# Altium schematic sheet ComparatorSense.SchDoc
size A3; SheetNumber: 6; SheetTotal: 7
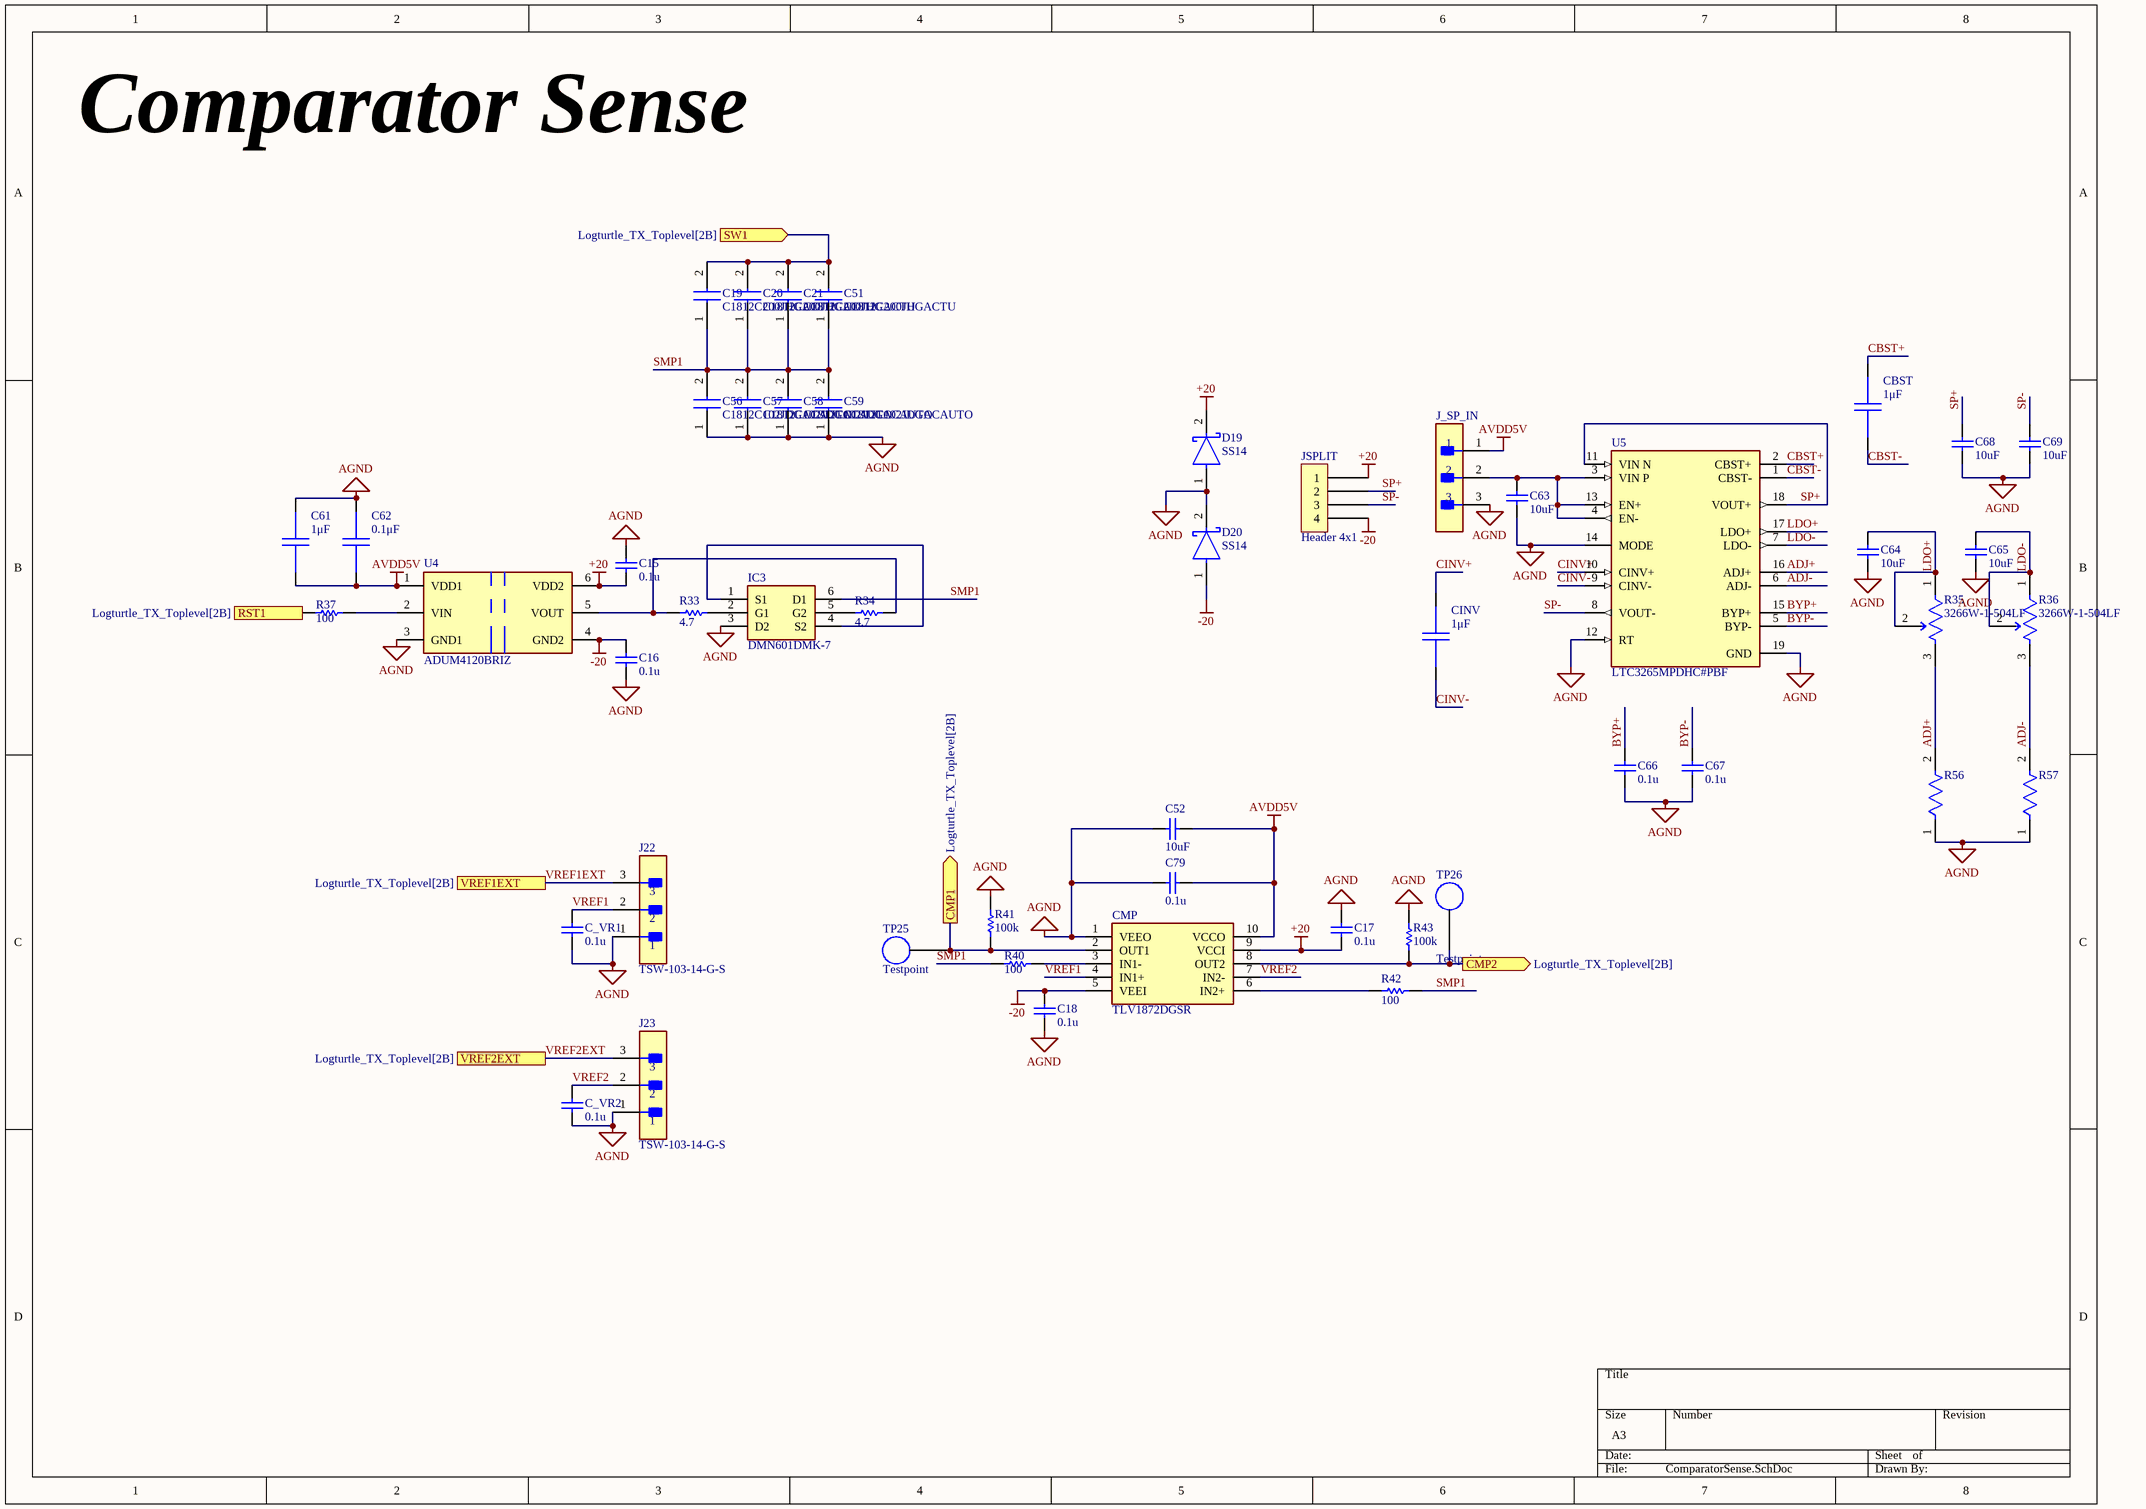
[diagram p0: ComparatorSense.SchDoc]

## Parts
C15  value 0.1u  [CAPC1608X09N]  (hidden comment: Capacitor)
C16  value 0.1u  [CAPC1608X09N]  (hidden comment: Capacitor)
C17  value 0.1u  [CAPC1608X09N]  (hidden comment: Capacitor)
C18  value 0.1u  [CAPC1608X09N]  (hidden comment: Capacitor)
C19  C1812C200JHGACTU  [C1812]
C20  C1812C200JHGACTU  [C1812]
C21  C1812C200JHGACTU  [C1812]
C51  C1812C200JHGACTU  [C1812]
C52  value 10uF  [CAPC2012X14N]  (hidden comment: 10μF)
C56  C1812C102JDGACAUTO  [C1812]
C57  C1812C102JDGACAUTO  [C1812]
C58  C1812C102JDGACAUTO  [C1812]
C59  C1812C102JDGACAUTO  [C1812]
C61  1μF  [CAPC1608X09N]
C62  0.1μF  [CAPC1608X90N]
C63  value 10uF  [CAPC2012X14N]  (hidden comment: 10μF)
C64  value 10uF  [CAPC2012X14N]  (hidden comment: 10μF)
C65  value 10uF  [CAPC2012X14N]  (hidden comment: 10μF)
C66  value 0.1u  [CAPC1608X09N]  (hidden comment: Capacitor)
C67  value 0.1u  [CAPC1608X09N]  (hidden comment: Capacitor)
C68  value 10uF  [CAPC2012X14N]  (hidden comment: 10μF)
C69  value 10uF  [CAPC2012X14N]  (hidden comment: 10μF)
C79  value 0.1u  [CAPC1608X09N]  (hidden comment: Capacitor)
C_VR1  value 0.1u  [CAPC1608X09N]  (hidden comment: Capacitor)
C_VR2  value 0.1u  [CAPC1608X09N]  (hidden comment: Capacitor)
CBST  1μF  [CAPC1608X09N]
CINV  1μF  [CAPC1608X09N]
CMP  TLV1872DGSR  [SOP50P490X110-10N]
D19  SS14  [FP-403AE-MFG]
D20  SS14  [FP-403AE-MFG]
IC3  DMN601DMK-7  [SOT95P285X140-6N]
J22  TSW-103-14-G-S  [FP-TSW-103-14-G-S-MFG]
J23  TSW-103-14-G-S  [FP-TSW-103-14-G-S-MFG]
J_SP_IN  TSW-103-14-G-S  [FP-TSW-103-14-G-S-MFG]  (value not drawn)
JSPLIT  Header 4x1  [HDRV4W64P0X254_1X4_1016X250X901P]
R33  value 4.7  [RESC1608X55N]  (hidden comment: RC0603FR-07100RL)
R34  value 4.7  [RESC1608X55N]  (hidden comment: RC0603FR-07100RL)
R35  3266W-1-504LF  [FP-3266W-MFG]
R36  3266W-1-504LF  [FP-3266W-MFG]
R37  value 100  [RESC1608X55N]  (hidden comment: RC0603FR-07100RL)
R40  value 100  [RESC1608X55N]  (hidden comment: RC0603FR-07100RL)
R41  value 100k  [RESC1608X55N]  (hidden comment: RC0603FR-07100KL)
R42  value 100  [RESC1608X55N]  (hidden comment: RC0603FR-07100RL)
R43  value 100k  [RESC1608X55N]  (hidden comment: RC0603FR-07100KL)
R56  TNPU060350K0HZEN00  [FP-TNPU0603-e3-MFG]  (value not drawn)
R57  TNPU060350K0HZEN00  [FP-TNPU0603-e3-MFG]  (value not drawn)
TP25  Testpoint  [TP_5006]
TP26  Testpoint  [TP_5006]
U4  ADUM4120BRIZ  [FP-RI-6-1-IPC_A]
U5  LTC3265MPDHC#PBF  [FP-DHC-18-05-08-1955-IPC_C]

## Ports
CMP1 (out, see Logturtle_TX_Toplevel[2B]), CMP2 (out, see Logturtle_TX_Toplevel[2B]), RST1 (in, see Logturtle_TX_Toplevel[2B]), SW1 (in, see Logturtle_TX_Toplevel[2B]), VREF1EXT (see Logturtle_TX_Toplevel[2B]), VREF2EXT (see Logturtle_TX_Toplevel[2B])

## Nets
+20: C15.2 C17.2 CMP.9(VCCI) D19.2(C) JSPLIT.1 U4.6(VDD2)
-20: C16.2 C18.2 CMP.5(VEEI) D20.1(A) JSPLIT.4 U4.4(GND2)
AGND: C15.1 C16.1 C17.1 C18.1 C52.1 C56.1 C57.1 C58.1 C59.1 C61.1 C62.1 C63.1 C64.1 C65.1 C66.2 C67.2 C68.1 C69.1 C79.2 C_VR1.1 C_VR2.1 CMP.1(VEEO) D19.1(A) D20.2(C) IC3.3(D2) J22.1 J23.1 J_SP_IN.3 R41.1 R43.1 R56.1 R57.1 U4.3(GND1) U5.12(RT) U5.14(MODE) U5.19(GND)
AVDD5V: C52.2 C61.2 C62.2 C79.1 CMP.10(VCCO) J_SP_IN.1 U4.1(VDD1)
ADJ+: R35.3(CW) R56.2 U5.16(ADJ+)
ADJ-: R36.3(CW) R57.2 U5.6(ADJ-)
BYP+: C66.1 U5.15(BYP+)
BYP-: C67.1 U5.5(BYP-)
CBST+: CBST.1 U5.2(CBST+)
CBST-: CBST.2 U5.1(CBST-)
CINV+: CINV.1 U5.10(CINV+)
CINV-: CINV.2 U5.9(CINV-)
CMP1: CMP.2(OUT1) R41.2 TP25.1 ; port CMP1
CMP2: CMP.8(OUT2) R43.2 TP26.1 ; port CMP2
LDO+: C64.2 R35.1(CCW) R35.2(WIPER) U5.17(LDO+)
LDO-: C65.2 R36.1(CCW) R36.2(WIPER) U5.7(LDO-)
RST1: R37.1 ; port RST1
SMP1: C19.1 C20.1 C21.1 C51.1 C56.2 C57.2 C58.2 C59.2 IC3.6(D1) R40.1 R42.1
SP+: C68.2 JSPLIT.2 U5.11(VIN_N) U5.18(VOUT+)
SP-: C69.2 JSPLIT.3 U5.8(VOUT-)
SW1: C19.2 C20.2 C21.2 C51.2 ; port SW1
VREF1: C_VR1.2 CMP.4(IN1+) J22.2
VREF1EXT: J22.3 ; port VREF1EXT
VREF2: C_VR2.2 CMP.7(IN2-) J23.2
VREF2EXT: J23.3 ; port VREF2EXT
NetC63_2: C63.2 J_SP_IN.2 U5.3(VIN_P) U5.4(EN-) U5.13(EN+)
NetCMP_3: CMP.3(IN1-) R40.2
NetCMP_6: CMP.6(IN2+) R42.2
NetIC3_1: IC3.1(S1) IC3.4(S2)
NetIC3_2: IC3.2(G1) R33.1
NetIC3_5: IC3.5(G2) R34.2
NetR33_2: R33.2 R34.1 U4.5(VOUT)
NetR37_2: R37.2 U4.2(VIN)

## Notes on the sheet
- Comparator Sense

## Library data of the parts
C15-C18 C66 C67 C79 C_VR1 C_VR2 = Capacitor: SimulationGenericComponent: True
C19-C21 C51 C56-C59 = C1812C102JDGACAUTO: Capacitor; Manufacturer_Name: YAGEO; Datasheet Link: https://content.kemet.com/datasheets/KEM_C1080_C0G_HV_AUTO_SMD.pdf; Height: 1.55mm; Manufacturer_Part_Number: C1812C102JDGACAUTO
C52 C63-C65 C68 C69 = GRM21BZ71E106KE15L: Multilayer Ceramic Capacitor, 10 uF, 25 V, ï¿½ 10%, X7R, 0805 [2012 Metric] https://www.digikey.ie/en/products/detail/murata-electronics/GRM21BZ71E106KE15L/13904911; Manufacturer: Murata; Material: 4241ConductorMaterial; Voltage Rating: 25V; Supplier: Future Electronics; Supplier Part Number: 6134628; Manufacturer Part Number: GRM21BZ71E106KE15L; Category: Ceramic Capacitors; Stock: 81000; Case/Package: 339Case; Min Operating Temperature: -55°C; Max Operating Temperature: 125°C; Tolerance: 10%; Length: 2mm; Width: 1.25mm; Height: 1.45mm; Thickness: 1.25mm; RoHS Compliant: Yes; ComponentLink1URL: https://datasheet.octopart.com/GRM21BZ71E106KE15L-Murata-datasheet-141278873.pdf?src-supplier=Geoflip; ComponentLink1Description: https://datasheet.octopart.com/GRM21BZ71E106KE15L-Murata-datasheet-141278873.pdf?src-supplier=Geoflip; ComponentLink2URL: https://datasheet.octopart.com/GRM21BZ71E106KE15L-Murata-datasheet-165579666.pdf?src-supplier=TME; ComponentLink2Description: https://datasheet.octopart.com/GRM21BZ71E106KE15L-Murata-datasheet-165579666.pdf?src-supplier=TME; ComponentLink3URL: https://datasheet.octopart.com/GRM21BZ71E106KE15L-Murata-datasheet-140707837.pdf?src-supplier=Ciiva+Crawler; ComponentLink3Description: https://datasheet.octopart.com/GRM21BZ71E106KE15L-Murata-datasheet-140707837.pdf?src-supplier=Ciiva+Crawler; ComponentLink4URL: https://datasheet.octopart.com/GRM21BZ71E106KE15L-Murata-datasheet-138745134.pdf?src-supplier=Ciiva+Crawler; ComponentLink4Description: https://datasheet.octopart.com/GRM21BZ71E106KE15L-Murata-datasheet-138745134.pdf?src-supplier=Ciiva+Crawler
C61 CBST CINV = CC0603KRX7R7BB105: Ceramic Capacitor, Multilayer, Ceramic, 16V, 10% +Tol, 10% -Tol, X7R, 15% TC, 1uF, Surface Mount, 0603 https://www.digikey.ie/en/products/detail/yageo/CC0603KRX7R7BB105/2833611; Manufacturer: Yageo; Multilayer: Yes; Supplier: Digikey; Supplier Part Number: 311-1446-6-ND; Manufacturer Part Number: CC0603KRX7R7BB105; RoHS: Yes; Category: Ceramic Capacitors; Stock: 9128438; Mounting Technology: Surface Mount; Pins: 2; Dielectric Material: Ceramic; Package Shape: Rectangular; Case/Package: 0603; Terminal Finish: Nickel; Min Operating Temperature: -55°C; Max Operating Temperature: 125°C; JESD-609 Code: e3; Value: 1uF; Capacitor Type: Ceramic; Tolerance  (fill in as +-): 10%; Package Style: SMTMeter; Packaging: Tape and Reel; Tolerance (fill in as +-): 10%; Rated DC Voltage (URdc): 16V; Temperature Characteristics Code: X7R; Termination: Wraparound; Length: 1.6mm; Width: 0.8mm; Height: 0.8mm; Reach SVHC Compliant: Yes; RoHS Compliant: Yes; ComponentLink1URL: https://datasheet.ciiva.com:443/pdfs/VipMasterIC/IC/YAGO/YAGO-S-A0003557223/YAGO-S-A0003557223-1.pdf?src-supplier=IHS+Markit; ComponentLink1Description: https://datasheet.ciiva.com:443/pdfs/VipMasterIC/IC/YAGO/YAGO-S-A0003557223/YAGO-S-A0003557223-1.pdf?src-supplier=IHS+Markit; ComponentLink2URL: https://datasheet.ciiva.com/8033/1734573-8033801.pdf?src-supplier=Element14; ComponentLink2Description: https://datasheet.ciiva.com/8033/1734573-8033801.pdf?src-supplier=Element14; ComponentLink3URL: https://datasheet.ciiva.com/8033/1734573-8033800.pdf?src-supplier=Element14; ComponentLink3Description: https://datasheet.ciiva.com/8033/1734573-8033800.pdf?src-supplier=Element14; ComponentLink4URL: https://datasheet.ciiva.com/7978/1489800-7978143.pdf?src-supplier=Element14; ComponentLink4Description: https://datasheet.ciiva.com/7978/1489800-7978143.pdf?src-supplier=Element14; ComponentLink5URL: https://datasheet.ciiva.com/28450/1489800-28450557.pdf?src-supplier=Element14; ComponentLink5Description: https://datasheet.ciiva.com/28450/1489800-28450557.pdf?src-supplier=Element14; ComponentLink6URL: https://datasheet.ciiva.com/176/mlccorderingcode-176789.pdf?src-supplier=Digikey; ComponentLink6Description: https://datasheet.ciiva.com/176/mlccorderingcode-176789.pdf?src-supplier=Digikey; ComponentLink7URL: https://datasheet.ciiva.com/176/mlccorderingcode-176788.pdf?src-supplier=Digikey; ComponentLink7Description: https://datasheet.ciiva.com/176/mlccorderingcode-176788.pdf?src-supplier=Digikey; ComponentLink8URL: https://datasheet.ciiva.com/176/mlccorderingcode-176790.pdf?src-supplier=Digikey; ComponentLink8Description: https://datasheet.ciiva.com/176/mlccorderingcode-176790.pdf?src-supplier=Digikey; ComponentLink9URL: https://datasheet.ciiva.com/5425/upy-gphc-x7r-6-3v-to-50v-8-12304-5425495.pdf?src-supplier=Mouser; ComponentLink9Description: https://datasheet.ciiva.com/5425/upy-gphc-x7r-6-3v-to-50v-8-12304-5425495.pdf?src-supplier=Mouser
C62 = CC0603KRX7R7BB104: Ceramic Capacitor, Multilayer, Ceramic, 16V, 10% +Tol, 10% -Tol, X7R, 15% TC, 0.1uF, Surface Mount, 0603 https://www.digikey.ie/en/products/detail/yageo/CC0603KRX7R7BB104/302822; Manufacturer: Yageo; Value: 100nF; Multilayer: Yes; Supplier: Digikey; Supplier Part Number: 311-1088-1-ND; Manufacturer Part Number: CC0603KRX7R7BB104; RoHS: Yes; Category: Ceramic Capacitors; Stock: 8597331; Mounting Technology: Surface Mount; Pins: 2; Dielectric Material: Ceramic; Package Shape: Rectangular; Case/Package: 0603; Terminal Finish: Nickel; Min Operating Temperature: -55°C; Max Operating Temperature: 125°C; JESD-609 Code: e3; Capacitor Type: Ceramic; Tolerance  (fill in as +-): 10%; Package Style: SMTMeter; Packaging: Tape and Reel; Tolerance (fill in as +-): 10%; Rated DC Voltage (URdc): 16V; Temperature Characteristics Code: X7R; Termination: Wraparound; Length: 1.6mm; Width: 0.8mm; Height: 0.8mm; Reach SVHC Compliant: Yes; RoHS Compliant: Yes; ComponentLink1URL: https://datasheet.ciiva.com:443/pdfs/VipMasterIC/IC/YAGO/YAGO-S-A0003557223/YAGO-S-A0003557223-1.pdf?src-supplier=IHS+Markit; ComponentLink1Description: https://datasheet.ciiva.com:443/pdfs/VipMasterIC/IC/YAGO/YAGO-S-A0003557223/YAGO-S-A0003557223-1.pdf?src-supplier=IHS+Markit; ComponentLink2URL: https://datasheet.ciiva.com/11786/0900766b80d84f1d-11786077.pdf?src-supplier=Rs; ComponentLink2Description: https://datasheet.ciiva.com/11786/0900766b80d84f1d-11786077.pdf?src-supplier=Rs; ComponentLink3URL: https://datasheet.ciiva.com/8033/70765-8033799.pdf?src-supplier=Element14; ComponentLink3Description: https://datasheet.ciiva.com/8033/70765-8033799.pdf?src-supplier=Element14; ComponentLink4URL: https://datasheet.ciiva.com/7978/1489800-7978141.pdf?src-supplier=Element14; ComponentLink4Description: https://datasheet.ciiva.com/7978/1489800-7978141.pdf?src-supplier=Element14; ComponentLink5URL: https://datasheet.ciiva.com/28450/1489800-28450552.pdf?src-supplier=Element14; ComponentLink5Description: https://datasheet.ciiva.com/28450/1489800-28450552.pdf?src-supplier=Element14; ComponentLink6URL: https://datasheet.ciiva.com/46430/1734573-46430156.pdf?src-supplier=Element14; ComponentLink6Description: https://datasheet.ciiva.com/46430/1734573-46430156.pdf?src-supplier=Element14; ComponentLink7URL: https://datasheet.ciiva.com/144/mlccorderingcode-144183.pdf?src-supplier=Digikey; ComponentLink7Description: https://datasheet.ciiva.com/144/mlccorderingcode-144183.pdf?src-supplier=Digikey; ComponentLink8URL: https://datasheet.ciiva.com/144/mlccorderingcode-144182.pdf?src-supplier=Digikey; ComponentLink8Description: https://datasheet.ciiva.com/144/mlccorderingcode-144182.pdf?src-supplier=Digikey; ComponentLink9URL: https://datasheet.ciiva.com/144/mlccorderingcode-144184.pdf?src-supplier=Digikey; ComponentLink9Description: https://datasheet.ciiva.com/144/mlccorderingcode-144184.pdf?src-supplier=Digikey; ComponentLink10URL: https://datasheet.ciiva.com/8033/1734573-8033797.pdf?src-supplier=Element14; ComponentLink10Description: https://datasheet.ciiva.com/8033/1734573-8033797.pdf?src-supplier=Element14; ComponentLink11URL: https://datasheet.ciiva.com/13395/upy-gphc-x7r-6-3v-to-50v-8-13395674.pdf?src-supplier=Mouser; ComponentLink11Description: https://datasheet.ciiva.com/13395/upy-gphc-x7r-6-3v-to-50v-8-13395674.pdf?src-supplier=Mouser
CMP = TLV1872DGSR: Integrated Circuit; Manufacturer_Name: Texas Instruments; Datasheet Link: https://www.ti.com.cn/cn/lit/ds/symlink/tlv1872.pdf?ts=1725938037960&ref_url=https%253A%252F%252Fwww.ti.com.cn%252Fproduct%252Fcn%252FTLV1872; Height: 1.1mm; Manufacturer_Part_Number: TLV1872DGSR; Mouser Part Number: 595-TLV1872DGSR; Mouser Price/Stock: https://www.mouser.co.uk/ProductDetail/Texas-Instruments/TLV1872DGSR?qs=ZcfC38r4PotGaIsZlTBhhw%3D%3D; Arrow Part Number: TLV1872DGSR; Arrow Price/Stock: https://www.arrow.com/en/products/tlv1872dgsr/texas-instruments?utm_currency=USD&region=nac
D19 D20 = CMP-2000-04943-2: DIODE SCHOTTKY 40V 1A SMA; Manufacturer: ON Semiconductor; Peak Reverse Current: 0.2mA; Max Junction Temp: +125°C; Standoff Height: 0.05mm; Max Surge Forward Current: 40A; Mouser Description: Schottky Diodes & Rectifiers SMA 40V 1.0A; RoHS: TRUE; Lead Free: Yes; Manufacturer Part Number: SS14; Device Class L3: Schottky Diodes; Category: Diode; Automotive: No; Digikey Description: DIODE SCHOTTKY 40V 1A SMA; ComponentLink2Description: Datasheet; Device Class L2: Diodes; Height: 2.5mm; Temperature Range High: +125°C; ComponentLink2URL: https://www.onsemi.com/pub/Collateral/SS19-D.PDF; Device Class L1: Discrete Semiconductors; Package: 403AE; Octopart: https://octopart.com/ss14-on+semiconductor-29205033; Max Repetitive Reverse Voltage: 40V; Temperature Range Low: -65°C; Forward Current: 1A; Temperature: -65°C to +125°C
IC3 = DMN601DMK-7: MOSFET (N-Channel); Manufacturer_Name: Diodes Incorporated; Datasheet Link: https://www.diodes.com//assets/Datasheets/ds30657.pdf; Height: 1.4mm; Manufacturer_Part_Number: DMN601DMK-7; Mouser Part Number: 621-DMN601DMK-7; Mouser Price/Stock: https://www.mouser.co.uk/ProductDetail/Diodes-Incorporated/DMN601DMK-7?qs=mQbszxtPdlMzhImbd%2FELhA%3D%3D; Arrow Part Number: DMN601DMK-7; Arrow Price/Stock: https://www.arrow.com/en/products/dmn601dmk-7/diodes-incorporated
J22 J23 J_SP_IN = CMP-02766-001743-1: CONN HEADER VERT 3POS 2.54MM; Max Voltage Rating (AC): 550V; Number of Positions: 3; Max Current Rating: 7.6A; Gender: Male; Termination: Solder; RoHS Compliant: Yes; Mount: Through Hole; Lead Free: Lead Free; Connector Type: Header; REACH SVHC: No SVHC; Insulation Color: Black; Width: 2.54mm; Length: 7.62mm; Flammability Rating: UL94 V-0; Housing Material: Polyester; Contact Material: Bronze; Max Operating Temperature: 125°C; Fastening Type: Pull; Series: TSW; Number of Contacts: 3; Packaging: Bulk; Min Operating Temperature: -55°C; Package Quantity: 1; Height: 10.67mm; Pitch: 2.54mm; Contact Finish - Mating: GOLD; Contact Type: Male Pin; Radiation Hardening: No; Color: Black; Housing Color: Black; Contact Plating: Gold; Orientation: Straight; Number of Rows: 1; Depth: 2.54mm; Insulation Material: PBT; Contact Mating Length: 0.32inch; Contact Shape: Square
R33 R34 R37 R40 R42 = RC0603FR-07100RL: Resistor, 100 Ohms ±1% 0.1W, 1/10W Chip Resistor 0603 (1608 Metric) Moisture Resistant Thick Film; Manufacturer_Name: YAGEO; Datasheet Link: http://www.yageo.com/documents/recent/PYu-RC0603_51_RoHS_L_v5.pdf; Height: 0.55mm; Manufacturer_Part_Number: RC0603FR-07100RL; Mouser Part Number: 603-RC0603FR-07100RL; Mouser Price/Stock: https://www.mouser.co.uk/ProductDetail/YAGEO/RC0603FR-07100RL?qs=NEN%2FsE%2FLsvPIwIWKCOS4%2FA%3D%3D; Arrow Part Number: RC0603FR-07100RL; Arrow Price/Stock: https://www.arrow.com/en/products/rc0603fr-07100rl/yageo?region=europe
R35 R36 = CMP-07234-000050-1: TRIMMER 500KOHM 0.25W PC PIN TOP; Resistance Tolerance: 10%; Voltage Rating: 300V; Power Rating: 250mW; Resistance: 500kR; Lead Diameter: 0.5mm; Temperature Coefficient: 100ppm/°C; Number of Turns: 12; Resistor Type: Cermet; Type: Potentiometer; Height: 0.27inch; Packaging: Rail/Tube; Max Power Dissipation: 250mW; Voltage Rating (DC): 300V; Length: 6.71mm; Mount: Through Hole; Weight: 0.015oz; Depth: 4.5mm; Military Standard: Not; RoHS Compliant: Yes; Package Quantity: 100; Max Operating Temperature: 125°C; Width: 4.5mm; Lead Free: Lead Free; Tolerance: 10%; Radiation Hardening: No; Series: 3266; Technology: CERMET; Min Operating Temperature: -55°C; Termination: Pin; REACH SVHC: No SVHC; Color: Blue
R41 R43 = RC0603FR-07100KL: Resistor, 100 kOhms ±1% 0.1W, 1/10W Chip Resistor 0603 (1608 Metric) Moisture Resistant Thick Film; Manufacturer_Name: YAGEO; Datasheet Link: https://www.yageo.com/upload/media/product/productsearch/datasheet/rchip/PYu-RC_Group_51_RoHS_L_12.pdf; Height: 0.55mm; Manufacturer_Part_Number: RC0603FR-07100KL; Mouser Part Number: 603-RC0603FR-07100KL; Mouser Price/Stock: https://www.mouser.co.uk/ProductDetail/YAGEO/RC0603FR-07100KL?qs=e1ok2LiJcmaihem8Va5%2Fsw%3D%3D; Arrow Part Number: RC0603FR-07100KL; Arrow Price/Stock: https://www.arrow.com/en/products/rc0603fr-07100kl/yageo?utm_currency=USD&region=europe
R56 R57 = CMP-02407-013067-1: RES SMD 50K OHM 0.02% 1/10W 0603; Temperature Coefficient: 5ppm/°C; Max Power Dissipation: 100mW; Resistance: 50kR; Max Operating Temperature: 125°C; Min Operating Temperature: -55°C; Case Code (Metric): 1608; Features: Moisture Resistant; Resistor Type: Thin Film; Packaging: Cut Tape; Case/Package: 0603; Tolerance: 0.02%; Number of Terminations: 2; Case Code (Imperial): 0603
U4 = CMP-09133-000053-1: DGTL ISO 5KV 1CH GATE DRVR 6SOIC; Number of Channels: 1; Pulse Width Distortion (PWD): 16.5ns; Max Output Current: 2.3A; Propagation Delay: 79ns; Approvals: CSA; Number of Pins: 6; Series: iCoupler®; Mount: Surface Mount; Max Operating Temperature: 125°C; RoHS Compliant: Yes; Packaging: Rail/Tube; Min Operating Temperature: -40°C; Case/Package: SOIC
U5 = CMP-09139-000695-1: IC REG CHARGE PUMP INV 18DFN; Min Input Voltage: 4.5V; Output Current: 100mA; Synchronous Rectifier: No; Number of Outputs: 2; Output Type: Fixed; Switching Frequency: 500kHz; Max Input Voltage: 32V; Number of Pins: 18; Min Operating Temperature: -55°C; Mount: Surface Mount; RoHS Compliant: Yes; Packaging: Rail/Tube; Case/Package: DFN; Topology: Charge Pump; Series: -; Max Operating Temperature: 150°C